# EAGLE design amp (EAGLE 6.4)
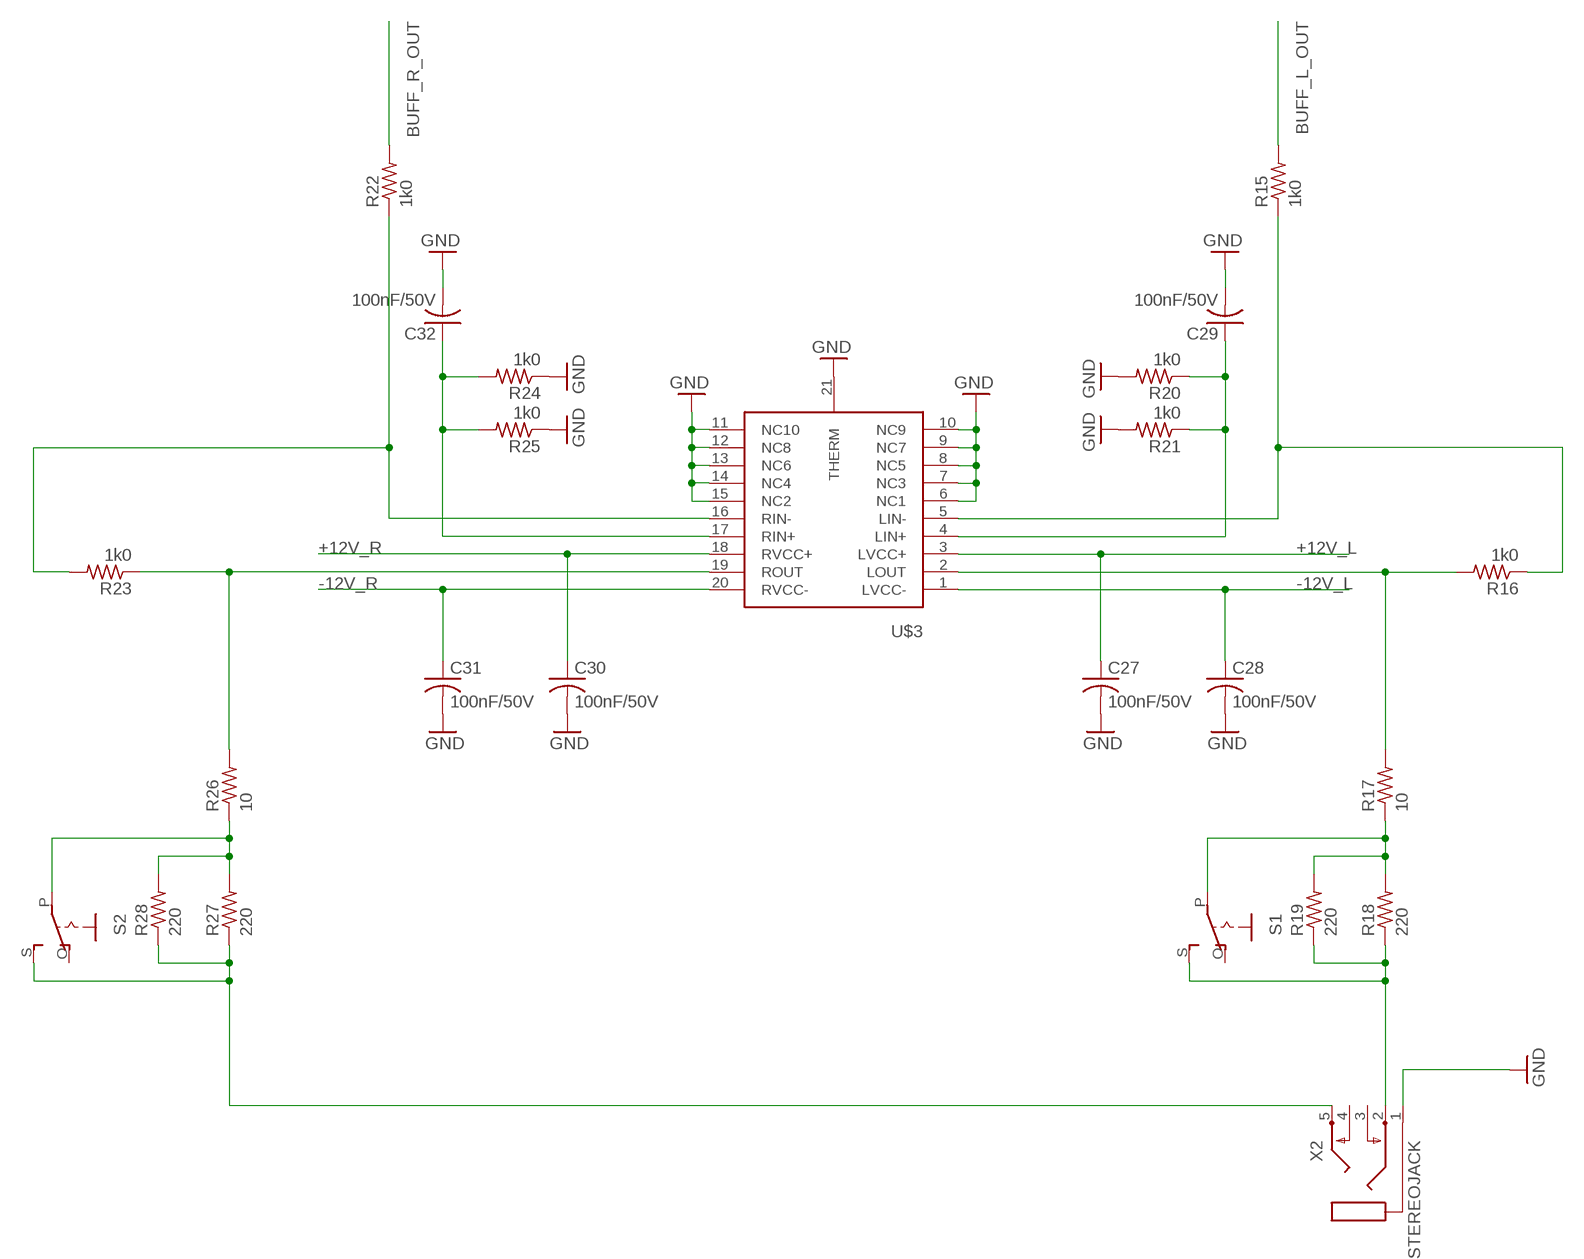
[diagram p0: schematic, sheet 1]

## Parts
C27  100nF/50V  C-USC0805  [C0805]
C28  100nF/50V  C-USC0805  [C0805]
C29  100nF/50V  C-USC0805  [C0805]
C30  100nF/50V  C-USC0805  [C0805]
C31  100nF/50V  C-USC0805  [C0805]
C32  100nF/50V  C-USC0805  [C0805]
R15  1k0  R-US_M0805  [M0805]
R16  1k0  R-US_M0805  [M0805]
R17  10  R-US_M0805  [M0805]
R18  220  R-US_M0805  [M0805]
R19  220  R-US_M0805  [M0805]
R20  1k0  R-US_M0805  [M0805]
R21  1k0  R-US_M0805  [M0805]
R22  1k0  R-US_M0805  [M0805]
R23  1k0  R-US_M0805  [M0805]
R24  1k0  R-US_M0805  [M0805]
R25  1k0  R-US_M0805  [M0805]
R26  10  R-US_M0805  [M0805]
R27  220  R-US_M0805  [M0805]
R28  220  R-US_M0805  [M0805]
S1  EG1218S  [EG1218]
S2  EG1218S  [EG1218]
U$3  TPA6120  [TPA6120]
X2  STEREOJACK  [STX3100]

## Nets
+12V_L: C27.1 U$3.3(LVCC+)
+12V_R: C30.1 U$3.18(RVCC+)
-12V_L: C28.1 U$3.1(LVCC-)
-12V_R: C31.1 U$3.20(RVCC-)
BUFF_L_OUT: R15.2
BUFF_R_OUT: R22.2
GND: C27.2 C28.2 C29.2 C30.2 C31.2 C32.2 R20.2 R21.2 R24.1 R25.1 U$3.6(NC1) U$3.7(NC3) U$3.8(NC5) U$3.9(NC7) U$3.10(NC9) U$3.11(NC10) U$3.12(NC8) U$3.13(NC6) U$3.14(NC4) U$3.15(NC2) U$3.21(THERM) X2.1
N$5: R15.1 R16.1 U$3.5(LIN-)
N$6: R16.2 R17.2 U$3.2(LOUT)
N$10: R17.1 R18.2 R19.2 S1.P
N$12: R18.1 R19.1 S1.S X2.2
N$13: C29.1 R20.1 R21.1 U$3.4(LIN+)
N$15: R22.1 R23.2 U$3.16(RIN-)
N$16: R23.1 R26.2 U$3.19(ROUT)
N$18: C32.1 R24.2 R25.2 U$3.17(RIN+)
N$19: R26.1 R27.2 R28.2 S2.P
N$20: R27.1 R28.1 S2.S X2.5
Unconnected: S1.O S2.O X2.3 X2.4

## Library data of the parts
C27-C32 = rcl:C-US: CAPACITOR, American symbol
R15-R28 = rcl:R-US_: RESISTOR, American symbol
S1 S2 = adafruit:EG1218: SLIDING SWITCH 0.1" spacing through hole, vertical SPDT slide switch http://www.ladyada.net/library/pcb/eaglelibrary.html
U$3 = tpa6120:TPA6120
X2 = adafruit:STEREOJACK: MIC/HEADPHONE JACK Stereo jack with two switches. Kycon STX3100, CUI SJ1-3555NG and/or 4UCon 05544

## Board
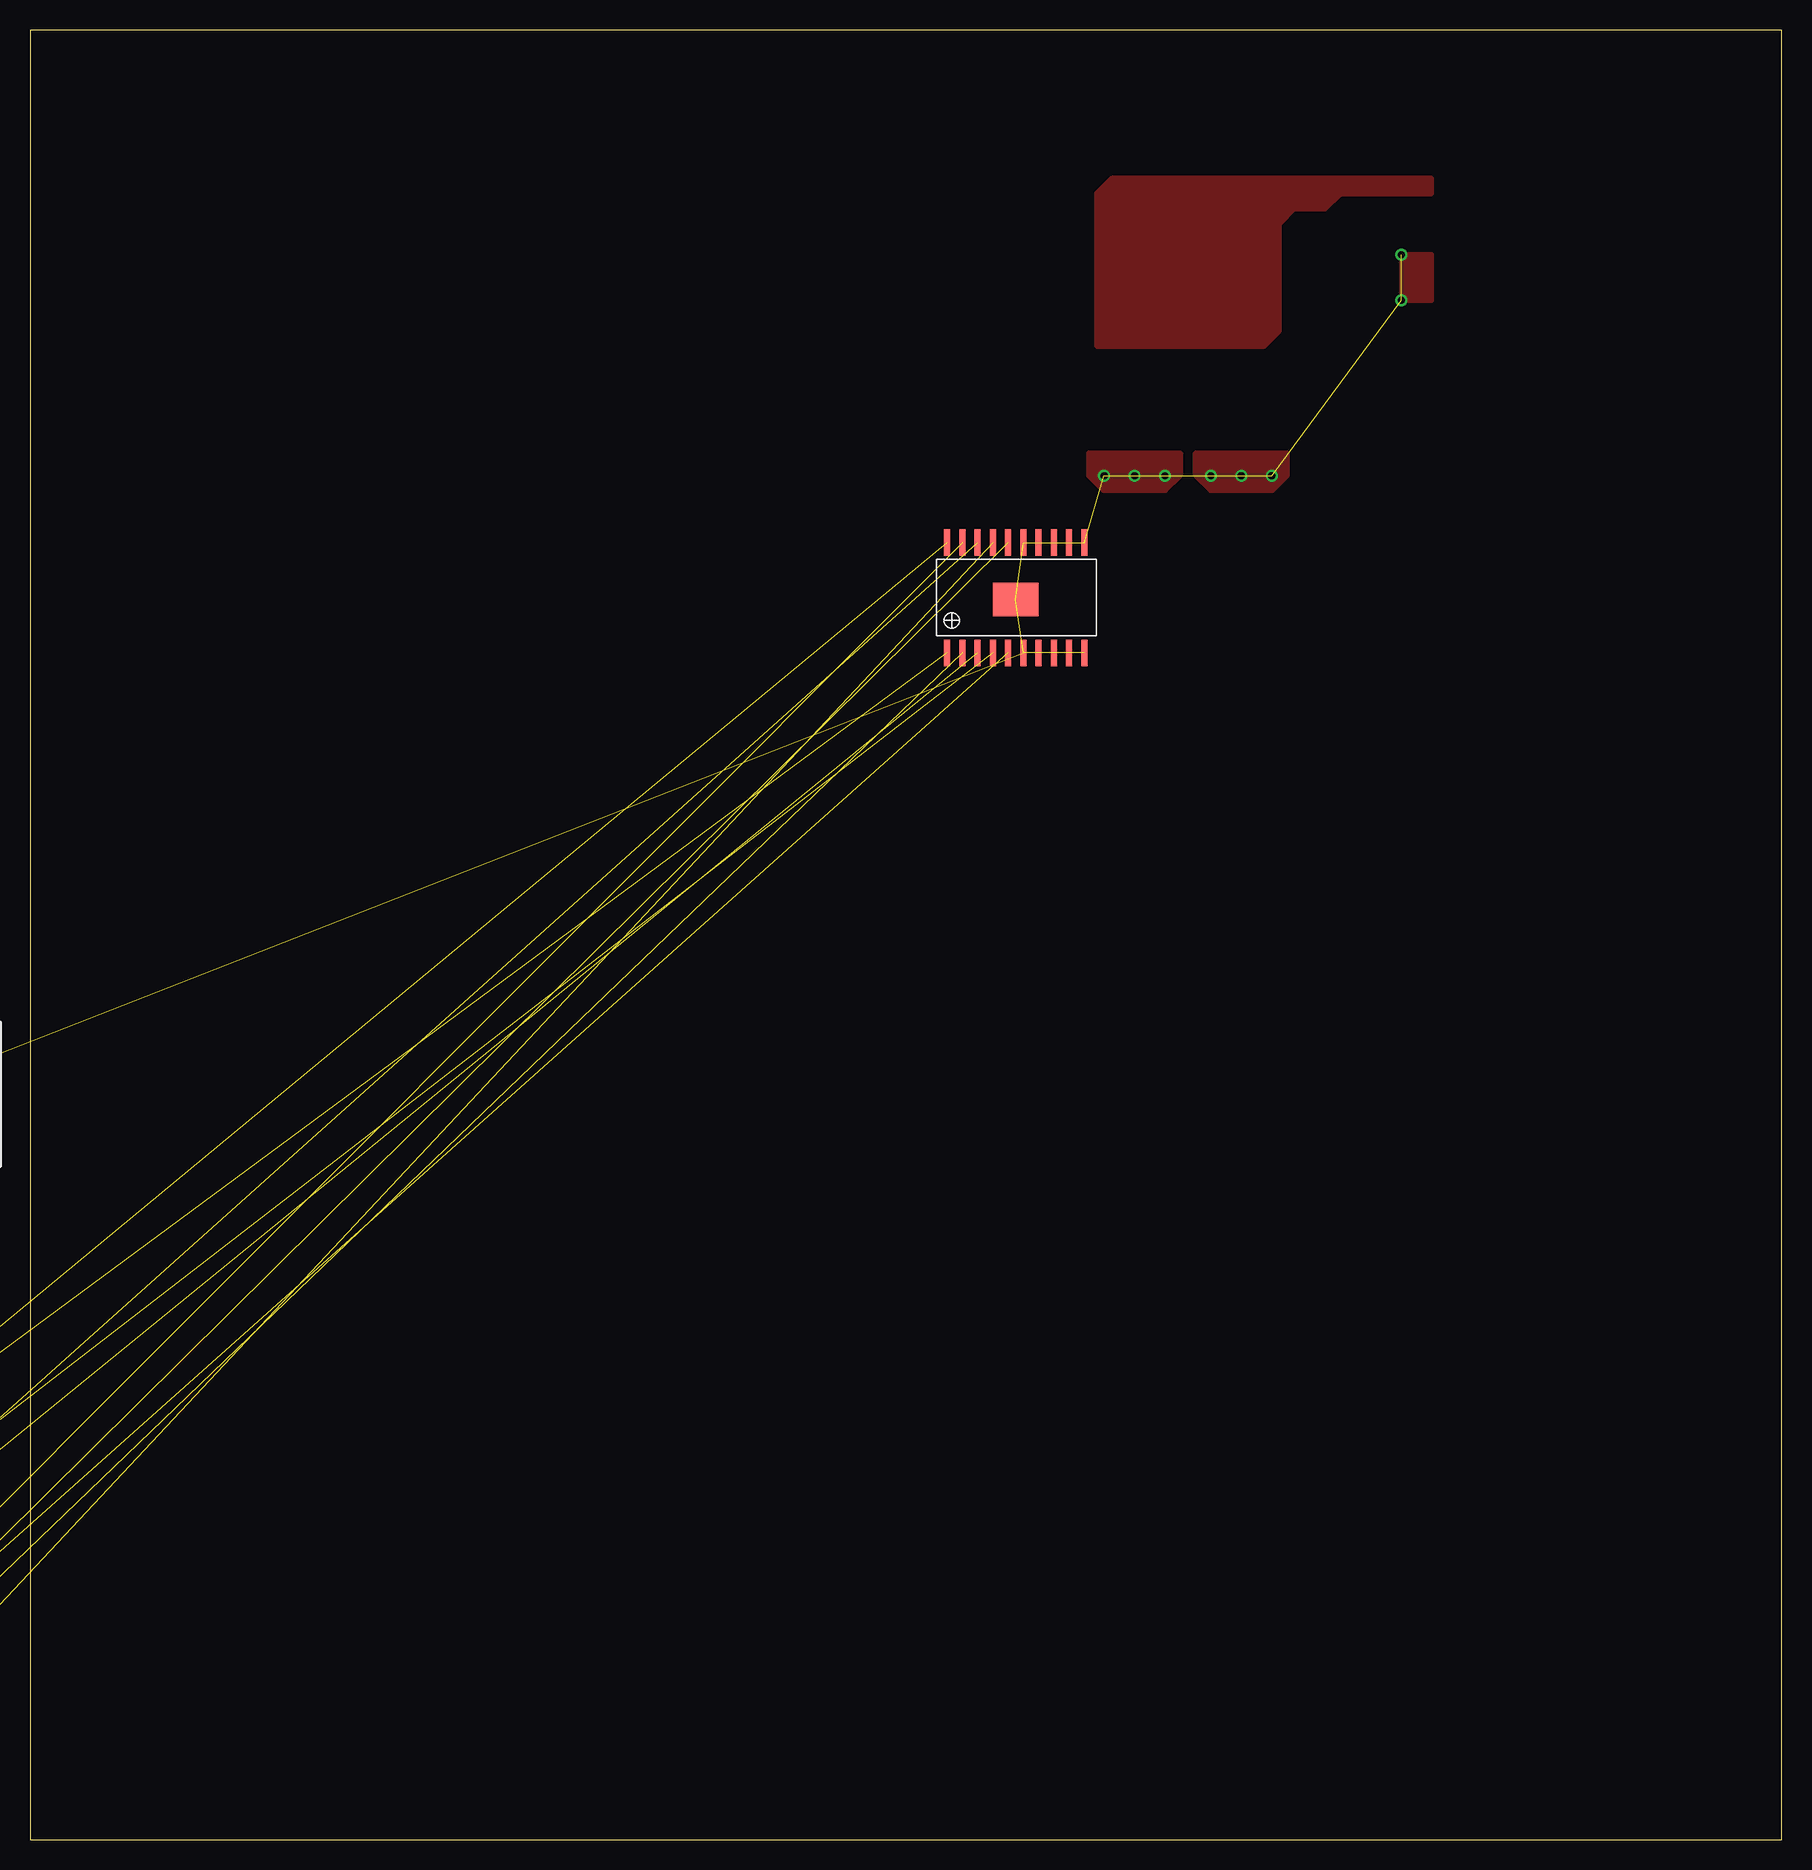
[diagram p1: board, top side]
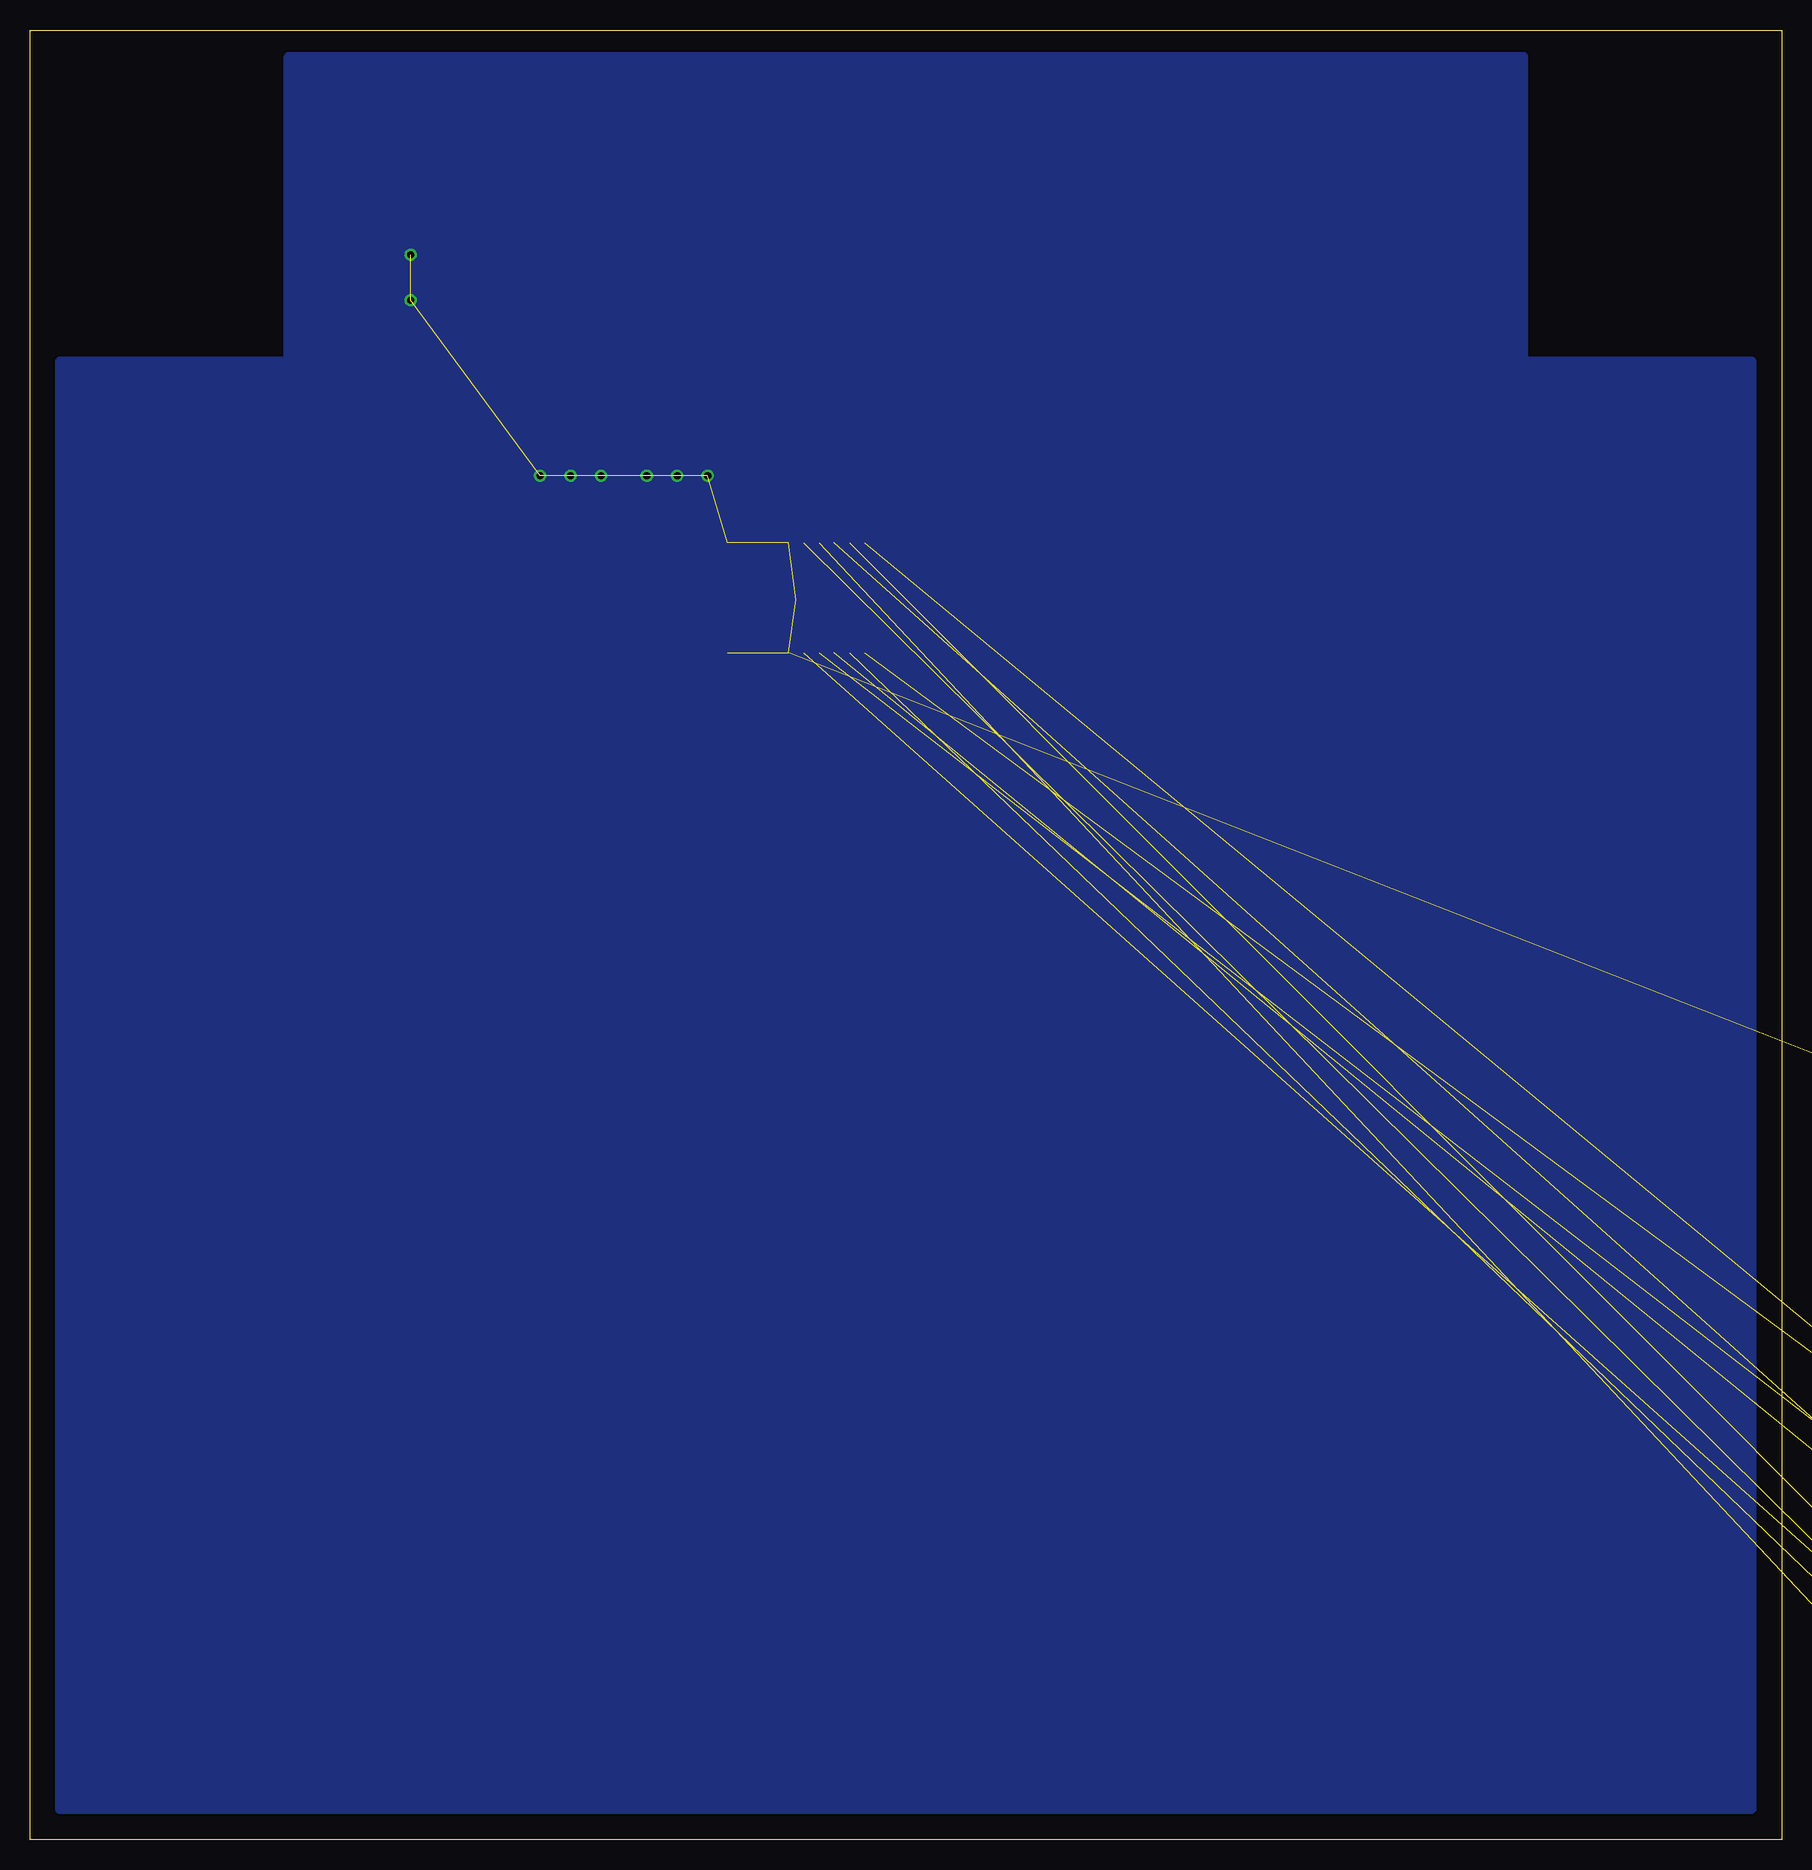
[diagram p2: board, bottom side, seen from below]

Size 146.03 x 150.8 mm. Coordinates in mm from the lower left corner, seen from the top.
Outline: 0,0 146.03,0 146.03,150.8 0,150.8 0,0
Copper layers (1*16): Top 0.035mm / dielectric 1.5mm / Bottom 0.035mm
Design rules "default": minimum track width 10mil, minimum drill 24mil, track to track 8mil, track to pad 8mil, pad to pad 8mil, via to via 8mil, smd to smd 8mil, copper to edge 40mil, drill to drill 8mil, minimum pad ring 10mil, minimum via ring 8mil, stop-mask expansion 4mil, vias tented up to drill 0mil, thermal gap 10mil

### Footprints (pad centres in the part's own frame; a part is rotated, then mirrored left to right if it is on the bottom)
C0805 = smd 1.3 x 1.5: 1 -0.95,0; 2 0.95,0
M0805 = smd 1.3 x 1.6: 1 -0.95,0; 2 0.95,0
EG1218 = drill 0.9 pad 1.676: O -2.54,0; P 0,0; S 2.54,0
TPA6120 = smd 0.5 x 2.2: 1 0.25,1.095; 2 1.52,1.095; 3 2.79,1.095; 4 4.06,1.095; 5 5.33,1.095; 6 6.6,1.095; 7 7.87,1.095; 8 9.14,1.095; 9 10.41,1.095; 10 11.68,1.095; 11 11.68,10.295; 12 10.41,10.295; 13 9.14,10.295; 14 7.87,10.295; 15 6.6,10.295; 16 5.33,10.295; 17 4.06,10.295; 18 2.79,10.295; 19 1.52,10.295; 20 0.25,10.295 | smd 3.81 x 2.79: 21 5.965,5.54
STX3100 = drill 1.5 pad 2.54: 1 2.7,-0.1 | drill 1.5: 2 7.7,5; 3 7.7,2.3; 4 7.7,-2.5; 5 7.7,-5.2 | hole 1.5: 2.7,4.9; 2.7,-5.1; 7.7,-0.1

### Placement (x,y rotation side)
C27  -71.12,-24.13 0 top  (outside the outline)
C28  -97.79,-30.48 0 top  (outside the outline)
C29  -86.36,-30.48 0 top  (outside the outline)
C30  -74.93,-30.48 0 top  (outside the outline)
C31  -97.79,-36.83 0 top  (outside the outline)
C32  -86.36,-36.83 0 top  (outside the outline)
R15  -74.93,-36.83 0 top  (outside the outline)
R16  -69.85,-36.83 0 top  (outside the outline)
R17  -64.77,-36.83 0 top  (outside the outline)
R18  -97.79,-43.18 0 top  (outside the outline)
R19  -92.71,-43.18 0 top  (outside the outline)
R20  -87.63,-43.18 0 top  (outside the outline)
R21  -82.55,-43.18 0 top  (outside the outline)
R22  -77.47,-43.18 0 top  (outside the outline)
R23  -72.39,-43.18 0 top  (outside the outline)
R24  -67.31,-43.18 0 top  (outside the outline)
R25  -62.23,-43.18 0 top  (outside the outline)
R26  -97.79,-49.53 0 top  (outside the outline)
R27  -92.71,-49.53 0 top  (outside the outline)
R28  -87.63,-49.53 0 top  (outside the outline)
S1  -92.71,-25.4 0 top  (outside the outline)
S2  -80.01,-25.4 0 top  (outside the outline)
U$3  76.2,97.79 0 top
X2  -13.97,62.23 0 top  (outside the outline)

### Tracks (layer width: path | path; a pad name or v marks a point on that pad's centre or on a via)
+12V_L  (1 unrouted)
+12V_R  (1 unrouted)
+VSS_NOREG
  pour Top (no thermals): 116.84,138.43 90.17,138.43 88.9,137.16 88.9,124.46 102.87,124.46 104.14,125.73 104.14,134.62 105.41,135.89 107.95,135.89 109.22,137.16 116.84,137.16
-12V_L  (1 unrouted)
-12V_R  (1 unrouted)
GND  (via drill 0.6)  (29 unrouted)
  other vias: 114.3,128.27 114.3,132.08 98.42,113.66 100.97,113.66 103.5,113.66 89.53,113.66 92.08,113.66 94.61,113.66
  pour Bottom: 21.59,148.59 21.59,123.19 2.54,123.19 2.54,2.54 143.51,2.54 143.51,123.19 124.46,123.19 124.46,148.59
  pour Top: 116.84,132.08 114.3,132.08 114.3,128.27 116.84,128.27
  pour Top: 97.16,115.57 104.78,115.57 104.78,113.66 103.5,112.39 98.42,112.39 97.16,113.66
  pour Top: 88.27,115.57 95.89,115.57 95.89,113.66 94.61,112.39 89.53,112.39 88.27,113.66
N$5  (2 unrouted)
N$6  (2 unrouted)
N$10  (3 unrouted)
N$12  (3 unrouted)
N$13  (3 unrouted)
N$15  (2 unrouted)
N$16  (2 unrouted)
N$18  (3 unrouted)
N$19  (3 unrouted)
N$20  (3 unrouted)